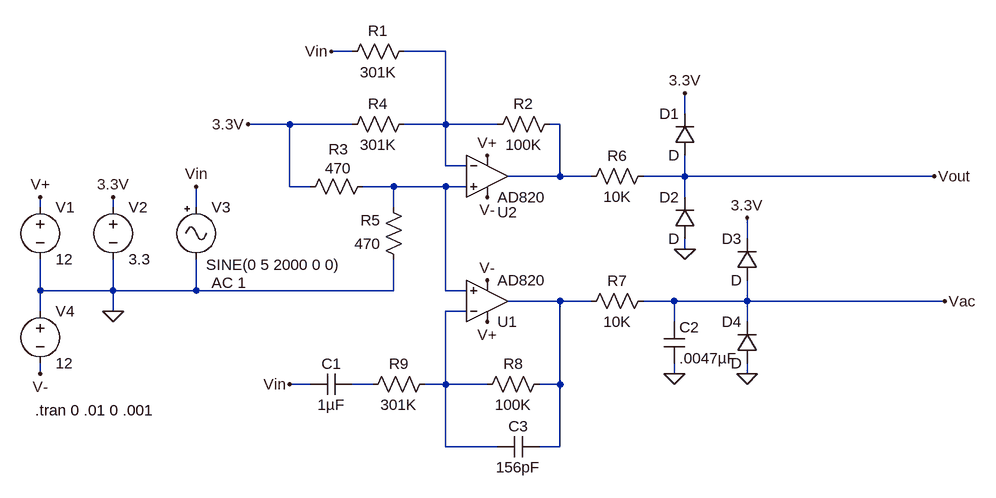
[diagram p0: schematic spank_input.asc]
spank_input.asc, the LTspice schematic file:
Version 4
SHEET 1 880 932
WIRE -192 256 -224 256
WIRE -48 256 -112 256
WIRE 320 352 320 320
WIRE -288 368 -352 368
WIRE -192 368 -288 368
WIRE -48 368 -48 256
WIRE -48 368 -112 368
WIRE 32 368 -48 368
WIRE 128 368 112 368
WIRE -48 432 -48 368
WIRE -16 432 -48 432
WIRE 128 448 128 368
WIRE 128 448 48 448
WIRE 176 448 128 448
WIRE 320 448 320 416
WIRE 320 448 256 448
WIRE 704 448 320 448
WIRE -288 464 -288 368
WIRE -256 464 -288 464
WIRE -128 464 -176 464
WIRE -48 464 -128 464
WIRE -16 464 -48 464
WIRE 320 480 320 448
WIRE -672 496 -672 480
WIRE -560 496 -560 480
WIRE -432 496 -432 464
WIRE -128 496 -128 464
WIRE 416 544 416 512
WIRE 320 560 320 544
WIRE -672 624 -672 576
WIRE -560 624 -560 576
WIRE -560 624 -672 624
WIRE -432 624 -432 576
WIRE -432 624 -560 624
WIRE -128 624 -128 576
WIRE -128 624 -432 624
WIRE -48 624 -48 464
WIRE -16 624 -48 624
WIRE 128 640 48 640
WIRE 176 640 128 640
WIRE 304 640 256 640
WIRE 416 640 416 608
WIRE 416 640 304 640
WIRE 720 640 416 640
WIRE -672 656 -672 624
WIRE -560 656 -560 624
WIRE -16 656 -48 656
WIRE 304 672 304 640
WIRE 416 672 416 640
WIRE -672 752 -672 736
WIRE 304 752 304 736
WIRE 416 752 416 736
WIRE -256 768 -288 768
WIRE -160 768 -192 768
WIRE -48 768 -48 656
WIRE -48 768 -80 768
WIRE 16 768 -48 768
WIRE 128 768 128 640
WIRE 128 768 96 768
WIRE -48 864 -48 768
WIRE 32 864 -48 864
WIRE 128 864 128 768
WIRE 128 864 96 864
FLAG -560 656 0
FLAG -672 480 V+
FLAG 16 416 V+
FLAG -672 752 V-
FLAG 16 480 V-
FLAG 16 608 V-
FLAG 16 672 V+
FLAG 704 448 Vout
FLAG 720 640 Vac
FLAG -560 480 3.3V
FLAG 320 320 3.3V
FLAG 320 560 0
FLAG -352 368 3.3V
FLAG -432 464 Vin
FLAG -224 256 Vin
FLAG -288 768 Vin
FLAG 416 512 3.3V
FLAG 416 752 0
FLAG 304 752 0
SYMBOL res 128 352 R90
WINDOW 0 0 56 VBottom 2
WINDOW 3 32 56 VTop 2
SYMATTR InstName R2
SYMATTR Value 100K
SYMBOL Misc\\signal -432 480 R0
WINDOW 123 24 132 Left 2
WINDOW 39 0 0 Left 0
WINDOW 3 15 104 Left 2
SYMATTR Value2 AC 1
SYMATTR Value SINE(0 5 2000 0 0)
SYMATTR InstName V3
SYMBOL voltage -560 480 R0
WINDOW 123 0 0 Left 0
WINDOW 39 0 0 Left 0
SYMATTR InstName V2
SYMATTR Value 3.3
SYMBOL Opamps\\AD820 16 384 R0
WINDOW 0 16 119 Left 2
SYMATTR InstName U2
SYMBOL voltage -672 480 R0
WINDOW 123 0 0 Left 0
WINDOW 39 0 0 Left 0
SYMATTR InstName V1
SYMATTR Value 12
SYMBOL voltage -672 640 R0
WINDOW 123 0 0 Left 0
WINDOW 39 0 0 Left 0
SYMATTR InstName V4
SYMATTR Value 12
SYMBOL res -96 240 R90
WINDOW 0 0 56 VBottom 2
WINDOW 3 32 56 VTop 2
SYMATTR InstName R1
SYMATTR Value 301K
SYMBOL Opamps\\AD820 16 704 M180
SYMATTR InstName U1
SYMBOL res -160 448 R90
WINDOW 0 -26 53 VBottom 2
WINDOW 3 -28 53 VTop 2
SYMATTR InstName R3
SYMATTR Value 470
SYMBOL res -112 592 R180
WINDOW 0 36 76 Left 2
WINDOW 3 36 40 Left 2
SYMATTR InstName R5
SYMATTR Value 470
SYMBOL res 272 432 R90
WINDOW 0 0 56 VBottom 2
WINDOW 3 32 56 VTop 2
SYMATTR InstName R6
SYMATTR Value 10K
SYMBOL cap -256 784 R270
WINDOW 0 32 32 VTop 2
WINDOW 3 0 32 VBottom 2
SYMATTR InstName C1
SYMATTR Value 1µF
SYMBOL res -96 352 R90
WINDOW 0 0 56 VBottom 2
WINDOW 3 32 56 VTop 2
SYMATTR InstName R4
SYMATTR Value 301K
SYMBOL diode 336 416 R180
WINDOW 0 24 64 Left 2
WINDOW 3 24 0 Left 2
SYMATTR InstName D1
SYMBOL diode 336 544 R180
WINDOW 0 24 64 Left 2
WINDOW 3 24 0 Left 2
SYMATTR InstName D2
SYMBOL res 112 752 R90
WINDOW 0 0 56 VBottom 2
WINDOW 3 32 56 VTop 2
SYMATTR InstName R8
SYMATTR Value 100K
SYMBOL res -64 752 R90
WINDOW 0 0 56 VBottom 2
WINDOW 3 32 56 VTop 2
SYMATTR InstName R9
SYMATTR Value 301K
SYMBOL res 272 624 R90
WINDOW 0 0 56 VBottom 2
WINDOW 3 32 56 VTop 2
SYMATTR InstName R7
SYMATTR Value 10K
SYMBOL diode 432 608 R180
WINDOW 0 24 64 Left 2
WINDOW 3 24 0 Left 2
SYMATTR InstName D3
SYMBOL diode 432 736 R180
WINDOW 0 24 64 Left 2
WINDOW 3 24 0 Left 2
SYMATTR InstName D4
SYMBOL cap 288 672 R0
SYMATTR InstName C2
SYMATTR Value .0047µF
SYMBOL cap 96 848 R90
WINDOW 0 0 32 VBottom 2
WINDOW 3 32 32 VTop 2
SYMATTR InstName C3
SYMATTR Value 156pF
TEXT -680 808 Left 2 !.tran 0 .01 0 .001

The netlist it stands for:
* spank_input.asc
R2 N002 N001 100K
V3 Vin 0 SINE(0 5 2000 0 0) AC 1
V2 3.3V 0 3.3
XU2 N003 N001 V+ V- N002 AD820  ; pins In+ In- V+ V- OUT
V1 V+ 0 12
V4 0 V- 12
R1 N001 Vin 301K
XU1 N003 N005 V+ V- N004 AD820  ; pins In+ In- V+ V- OUT
R3 N003 3.3V 470
R5 0 N003 470
R6 Vout N002 10K
C1 Vin N006 1µF
R4 N001 3.3V 301K
D1 Vout 3.3V D
D2 0 Vout D
R8 N004 N005 100K
R9 N005 N006 301K
R7 Vac N004 10K
D3 Vac 3.3V D
D4 0 Vac D
C2 Vac 0 .0047µF
C3 N004 N005 156pF
.model D D
.lib standard.dio
.tran 0 .01 0 .001
.backanno
.end